# EAGLE design arduinoM0Mini_start (EAGLE 9.1.3)
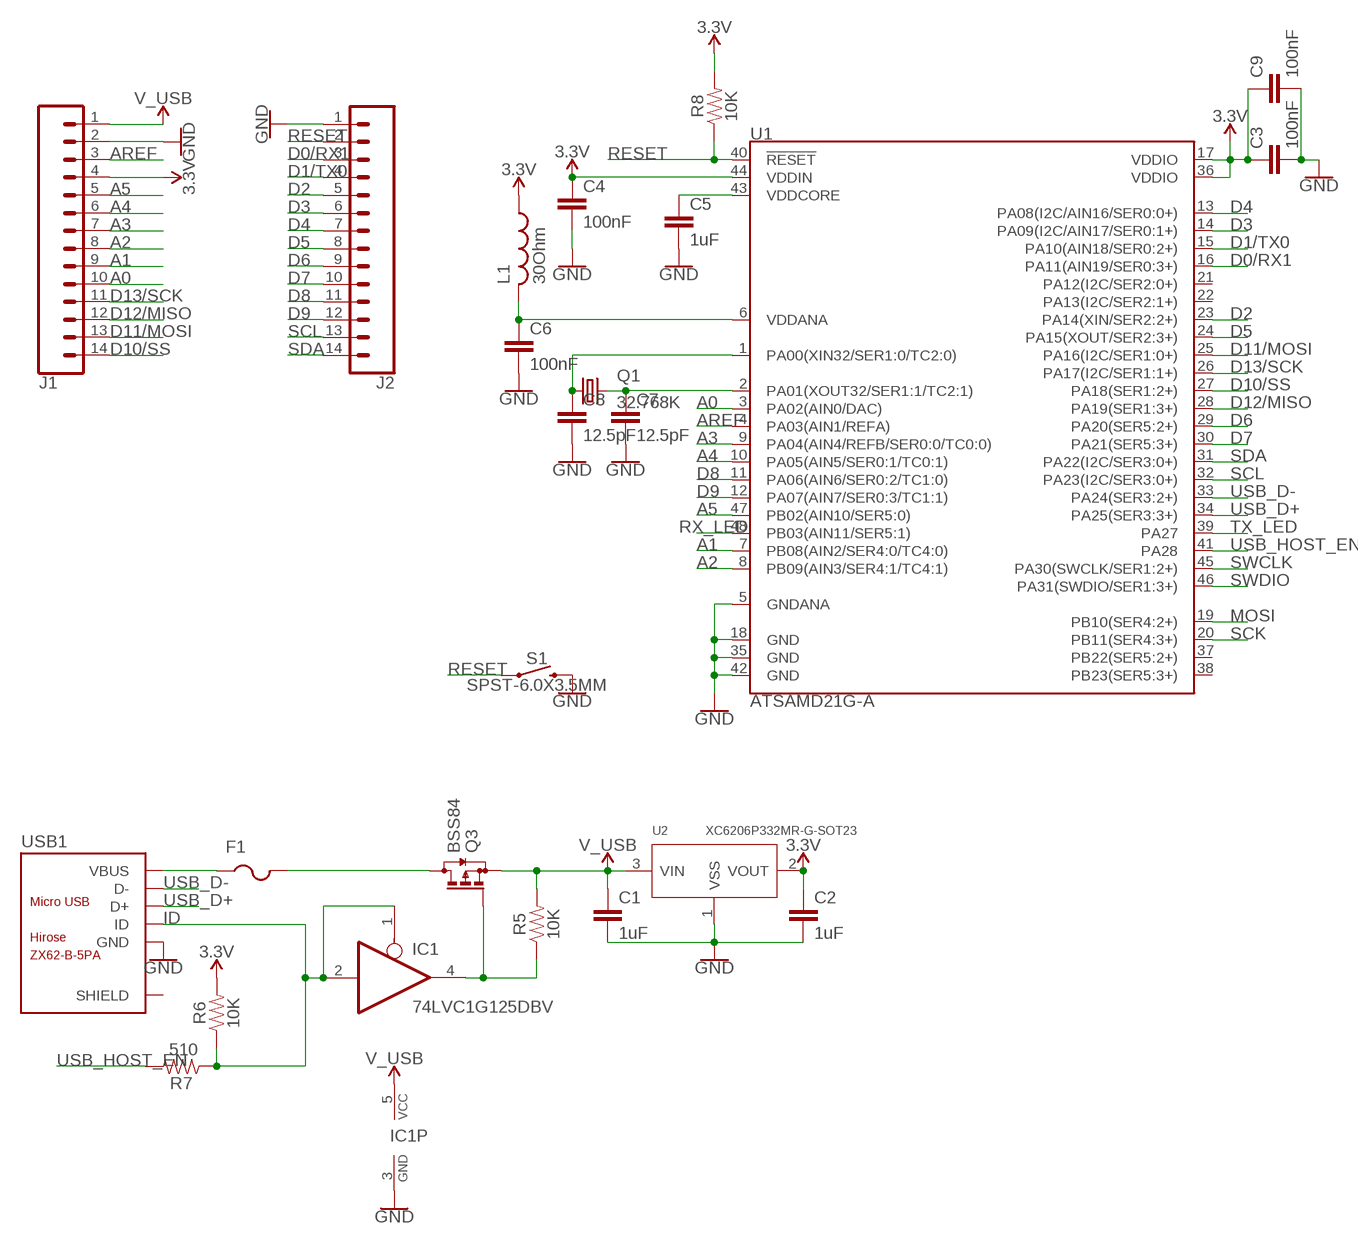
[diagram p0: schematic, sheet 1]

## Parts
C1  1uF  C-EUC0805K  [C0805K]
C2  1uF  C-EUC0805K  [C0805K]
C3  100nF  C-EUC0805K  [C0805K]
C4  100nF  C-EUC0805K  [C0805K]
C5  1uF  C-EUC0805K  [C0805K]
C6  100nF  C-EUC0805K  [C0805K]
C7  12.5pF  C-EUC0805K  [C0805K]
C8  12.5pF  C-EUC0805K  [C0805K]
C9  100nF  C-EUC0805K  [C0805K]
F1  PTCFUSE-1206  [R1206]
IC1  74LVC1G125DBV  [SOT23-5]
J1  CONN_14NO_SILK  [1X14_NO_SILK]
J2  CONN_14NO_SILK  [1X14_NO_SILK]
L1  30Ohm  INDUCTOR_0805_N  [RESC0805_N]
Q1  32.768K  KX-327-NHT  [3.2X1.5]
Q3  BSS84  [SOT23]
R5  10K  RESISTOR0805  [0805]
R6  10K  RESISTOR0805  [0805]
R7  510  RESISTOR0805  [0805]
R8  10K  RESISTOR0805  [0805]
S1  SPST-6.0X3.5MM  MOMENTARY-SWITCH-SPST-SMD-6.0X3.5MM  [TACTILE_SWITCH_SMD_6.0X3.5MM]
U1  ATSAMD21G-A  [TQFP-48]
U2  XC6206P332MR-G-SOT23  PMIC-LDO-XC6206P332MR-G(SOT23)  [SOT-23]
USB1  ZX62-B-5PA  MICRO-USB-SMD(ZX62-B-5PA)  [MICRO-USB5+6P-SMD-0.65-AB]

## Nets
3.3V: C2.1 C3.1 C4.1 C9.1 J1.4 L1.1 R6.2 R8.2 U1.17(VDDIO) U1.36(VDDIO) U1.44(VDDIN) U2.2(VOUT)
A0: J1.10 U1.3(PA02(AIN0/DAC))
A1: J1.9 U1.7(PB08(AIN2/SER4:0/TC4:0))
A2: J1.8 U1.8(PB09(AIN3/SER4:1/TC4:1))
A3: J1.7 U1.9(PA04(AIN4/REFB/SER0:0/TC0:0))
A4: J1.6 U1.10(PA05(AIN5/SER0:1/TC0:1))
A5: J1.5 U1.47(PB02(AIN10/SER5:0))
AREF: J1.3 U1.4(PA03(AIN1/REFA))
D0/RX1: J2.3 U1.16(PA11(AIN19/SER0:3+))
D1/TX0: J2.4 U1.15(PA10(AIN18/SER0:2+))
D2: J2.5 U1.23(PA14(XIN/SER2:2+))
D3: J2.6 U1.14(PA09(I2C/AIN17/SER0:1+))
D4: J2.7 U1.13(PA08(I2C/AIN16/SER0:0+))
D5: J2.8 U1.24(PA15(XOUT/SER2:3+))
D6: J2.9 U1.29(PA20(SER5:2+))
D7: J2.10 U1.30(PA21(SER5:3+))
D8: J2.11 U1.11(PA06(AIN6/SER0:2/TC1:0))
D9: J2.12 U1.12(PA07(AIN7/SER0:3/TC1:1))
D10/SS: J1.14 U1.27(PA18(SER1:2+))
D11/MOSI: J1.13 U1.25(PA16(I2C/SER1:0+))
D12/MISO: J1.12 U1.28(PA19(SER1:3+))
D13/SCK: J1.11 U1.26(PA17(I2C/SER1:1+))
GND: C1.2 C2.2 C3.2 C4.2 C5.2 C6.2 C7.2 C8.2 C9.2 IC1.3(GND) J1.2 J2.1 S1.2 U1.5(GNDANA) U1.18(GND) U1.35(GND) U1.42(GND) U2.1(VSS) USB1.5(GND)
ID: IC1.1(OE) IC1.2(I) R6.1 R7.1 USB1.4(ID)
MOSI: U1.19(PB10(SER4:2+))
N$3: C7.1 Q1.2 U1.2(PA01(XOUT32/SER1:1/TC2:1))
N$4: C8.1 Q1.1 U1.1(PA00(XIN32/SER1:0/TC2:0))
N$13: IC1.4(O) Q3.1(G) R5.1
N$14: F1.2 Q3.3(D)
RESET: J2.2 R8.1 S1.1 U1.40(!RESET!)
RX_LED: U1.48(PB03(AIN11/SER5:1))
SCK: U1.20(PB11(SER4:3+))
SCL: J2.13 U1.32(PA23(I2C/SER3:0+))
SDA: J2.14 U1.31(PA22(I2C/SER3:0+))
SWCLK: U1.45(PA30(SWCLK/SER1:2+))
SWDIO: U1.46(PA31(SWDIO/SER1:3+))
TX_LED: U1.39(PA27)
USB_D+: U1.34(PA25(SER3:3+)) USB1.3(D+)
USB_D-: U1.33(PA24(SER3:2+)) USB1.2(D-)
USB_HOST_EN: R7.2 U1.41(PA28)
V_USB: C1.1 IC1.5(VCC) J1.1 Q3.2(S) R5.2 U2.3(VIN)
V_USB_IN: F1.1 USB1.1(VBUS)
VDDADA: C6.1 L1.2 U1.6(VDDANA)
VDDCORE: C5.1 U1.43(VDDCORE)
Unconnected: U1.21(PA12(I2C/SER2:0+)) U1.22(PA13(I2C/SER2:1+)) U1.37(PB22(SER5:2+)) U1.38(PB23(SER5:3+)) USB1.P1(SHIELD) USB1.P2(SHIELD) USB1.P3(SHIELD) USB1.P4(SHIELD) USB1.P5(SHIELD) USB1.P6(SHIELD)

## Library data of the parts
C1 C2 C5 = rcl:C-EU: CAPACITOR, European symbol; LCSC: C16834; SPICEPREFIX: C
C3 C4 C6 C9 = rcl:C-EU: CAPACITOR, European symbol; LCSC: C1711; SPICEPREFIX: C
C7 C8 = rcl:C-EU: CAPACITOR, European symbol; LCSC: C1792; SPICEPREFIX: C
F1 = adafruit:PTCFUSE: PTC fuses, resettable thermistors; LCSC: C151162
IC1 = 74xx-little-us:74*1G125: Single Bus Buffer Gate with 3-State Output; LCSC: C23654
J1 J2 = SparkFun-Connectors:CONN_14: Multi connection point. Often used as Generic Header-pin footprint for 0.1 inch spaced/style header connections On any of the 0.1 inch spaced packages, you can populate with these: Break Away Headers - Straight <https://www.sparkfun.com/products/116> (PRT-00116) Break Away Male Headers - Right Angle <https://www.sparkfun.com/products/553> (PRT-00553) Female Headers <https://www.sparkfun.com/products/115> (PRT-00115) Break Away Headers - Machine Pin <https://www.sparkfun.com/products/117> (PRT-00117) Break Away Female Headers - Swiss Machine Pin <https://www.sparkfun.com/products/743> (PRT-00743) For SCREWTERMINALS and SPRING TERMINALS visit here: Screw Terimnals on SparkFun.com <https://www.sparkfun.com/search/results?term=Screw+Terminals> (5mm/3.5mm/2.54mm spacing) This device is also useful as a general connection point to wire up your design to another part of your project. Our various solder wires solder well into these plated through hole pads. Hook-Up Wire - Assortment (Stranded, 22 AWG) <https://www.sparkfun.com/products/11375> (PRT-11375) Hook-Up Wire - Assortment (Solid Core, 22 AWG) <https://www.sparkfun.com/products/11367> (PRT-11367) View the entire wire category on our website here <https://www.sparkfun.com/categories/141> Special notes: Molex polarized connector foot print use with SKU : PRT-08231 with associated crimp pins and housings. 1MM SMD Version SKU: PRT-10208 NOTES ON THE VARIANTS LOCK and LOCK_LONGPADS... This footprint was designed to help hold the alignment of a through-hole component (i.e. 6-pin header) while soldering it into place. You may notice that each hole has been shifted either up or down by 0.005 of an inch from it's more standard position (which is a perfectly straight line). This slight alteration caused the pins (the squares in the middle) to touch the edges of the holes. Because they are alternating, it causes a "brace" to hold the component in place. 0.005 has proven to be the perfect amount of "off-center" position when using our standard breakaway headers. Although looks a little odd when you look at the bare footprint, once you have a header in there, the alteration is very hard to notice. Also,if you push a header all the way into place, it is covered up entirely on the bottom side.
L1 = Nordic_nRF:INDUCTOR: Generic chip inductor; LCSC: C139190
Q1 = crystal-geyer_V1_0:KX-327: Tuning Fork Crystals (kHz) SMD: KX327 - Serie Model Size l/w/h [mm] Frequency Range Frequency Stability Temp. Range [°C] Load Capacitance AECQ 200 availabel Datasheet KX-327VT KX-327FT KX-327RT KX-327NHT KX-327NHF KX-327L KX-327S 1.25/1.05/0.5 1.6/1.0/0.5 2.0/1.2/0.6 3.2/1.5/0.8 3.2/1.5/0.8 7.0/1.5/1.4 8.2/3.8/2.5 32,768 kHz 32,768 kHz 32,768 kHz 32,768 kHz 32,768 kHz 32,768 kHz 32,768 kHz ±10 … ±20ppm ±10 … ±20ppm ±10 … ±20ppm ±10 … ±20ppm ±10 … ±20ppm ±10 … ±20ppm ±5 … ±20ppm (*) -40°C …+85°C (*) -40°C …+85°C (*) -40°C …+85°C (*) -40°C …+85°C (*) -40°C …+125°C (*) -40°C …+85°C (*) -40°C …+85°C 7/9/12,5 7/9/12,5 7/9/12,6 7/9/12,5 9/12,5 7/9/12,5 6/12,5 - - - - yes - - KX-327VT.pdf <http://www.geyer-electronic.de/uploads/tx_userartikelfrequenz/GEYER-KX-327VT.pdf> KX-327FT.pdf <http://www.geyer-electronic.de/uploads/tx_userartikelfrequenz/GEYER-KX-327FT.pdf> KX-327RT.pdf <http://www.geyer-electronic.de/uploads/tx_userartikelfrequenz/GEYER-KX-327RT.pdf> KX-327NHT.pdf <http://www.geyer-electronic.de/uploads/tx_userartikelfrequenz/GEYER-KX-327NHT.pdf> KX-327NHF.pdf <http://www.geyer-electronic.de/uploads/tx_userartikelfrequenz/GEYER-KX-327NHF.pdf> KX-327L.pdf <http://www.geyer-electronic.de/uploads/tx_userartikelfrequenz/GEYER-KX-327L.pdf> KX-327S.pdf <http://www.geyer-electronic.de/uploads/tx_userartikelfrequenz/GEYER-KX-327S.pdf> <http://www.geyer-electronic.de/fileadmin/template/img/logo-geyer-electronic.png> Details see: http://www.geyer-electronic.de/Frequenz-Produkte.9.0.html Created 2016-06-07, Hans Locher 2016 (C) Geyer Quartz Technology KX327VT,KX327FT,KX327RT,KX327NHT,KX327NHF,KX327S,KX327L;125105;1610;2012;3215;7015;8238;1,25x1,05,1.25x1.05;1,6x1,0,1.6x1.0;2,0x1,2,2.0x1.2;3,2x1,5,3.2x1.5;8,2x3,8,8.2x3.8,7.0x1.5,7,0x1,532.768kHz; LCSC: C32346
Q3 = transistor-small-signal:BSS84: P-CHANNEL MOS FET; LCSC: C8492
R5 R6 R8 = SparkFun-Resistors:RESISTOR: Generic Resistor Package; LCSC: C115309
R7 = SparkFun-Resistors:RESISTOR: Generic Resistor Package; LCSC: C17734
S1 = SparkFun-Switches:MOMENTARY-SWITCH-SPST: Momentary Switch (Pushbutton) - SPST Normally-open (NO) SPST momentary switches (buttons, pushbuttons). Variants PTH-12MM - 12mm square, through-hole Momentary Pushbutton Switch - 12mm Square <https://www.sparkfun.com/products/9190> (COM-09190) PTH-6.0MM, PTH-6.0MM-KIT - 6.0mm square, through-hole Mini Pushbutton Switch <https://www.sparkfun.com/products/97> (COM-00097) KIT package intended for soldering kit's - only one side of pads' copper is exposed. PTH-RIGHT-ANGLE-KIT - Right-angle, through-hole Right Angle Tactile Button <https://www.sparkfun.com/products/10791> - Used on SparkFun BigTime Watch Kit <https://www.sparkfun.com/products/11734> SMD-12MM - 12mm square, surface-mount Tactile Button - SMD (12mm) <https://www.sparkfun.com/products/12993> (COM-12993) Used on SparkFun PicoBoard <https://www.sparkfun.com/products/11888> SMD-4.5MM - 4.5mm Square Trackball Switch Used on SparkFun Blackberry Trackballer Breakout <https://www.sparkfun.com/products/13169> SMD-4.6MMX2.8MM - 4.60mm x 2.80mm, surface mount Used on SparkFun SAMD21 Mini Breakout <https://www.sparkfun.com/products/13664> SMD-5.2MM, SMD-5.2-REDUNDANT - 5.2mm square, surface-mount Mini Pushbutton Switch - SMD <https://www.sparkfun.com/products/8720> (COM-08720) Used on Arduino Pro Mini <https://www.sparkfun.com/products/11114> REDUNDANT package connects both switch circuits together SMD-6.0X3.5MM - 6.0 x 3.5mm, surface mount Momentary Reset Switch SMD <https://www.sparkfun.com/products/8229> (COM-08229) SMD-6.2MM-TALL - 6.2mm square, surface mount Tactile Button - SMD (6mm) <https://www.sparkfun.com/products/12992> Used on SparkFun Digital Sandbox <https://www.sparkfun.com/products/12651> SMD-RIGHT-ANGLE - Right-angle, surface mount Used on SparkFun Block for Intel® Edison - Arduino <https://www.sparkfun.com/products/13036>; LCSC: C139783; PROD_ID: SWCH-00815; SF_SKU: COM-08229
U1 = SparkFun-IC-Microcontroller:ATSAMD21G: Atmel SAMD21G SMART ARM-Based Microcontroller The Atmel ® | SMART ™ SAM D21 is a series of low-power microcontrollers using the 32-bit ARM ® Cortex ® -M0+ processor, and ranging from 32- to 64-pins with up to 256KB Flash and 32KB of SRAM. The SAM D21 devices operate at a maximum frequency of 48MHz and reach 2.46 CoreMark/MHz. They are designed for simple and intuitive migration with identical peripheral modules, hex compatible code, identical linear address map and pin compatible migration paths between all devices in the product series. All devices include intelligent and flexible peripherals, Atmel Event System for inter-peripheral signaling, and support for capacitive touch button, slider and wheel user interfaces. Datasheet <https://cdn.sparkfun.com/datasheets/Dev/Arduino/Boards/Atmel-42181-SAM-D21_Datasheet.pdf> SparkFun Products SparkFun SAMD21 Mini Breakout <https://www.sparkfun.com/products/13664> (DEV-13664) SparkFun SAMD21 Dev Breakout <https://www.sparkfun.com/products/13672> (DEV-13672); PROD_ID: IC-13064
U2 = Seeed-IC:PMIC-LDO-XC6206P332MR-G(SOT23): 310030099; LCSC: C5446; MPN: XC6206P332MR-G
USB1 = Seeed-Connector:MICRO-USB-SMD(ZX62-B-5PA): 320010005; LCSC: C10418; MPN: ZX62-B-5PA

## Board
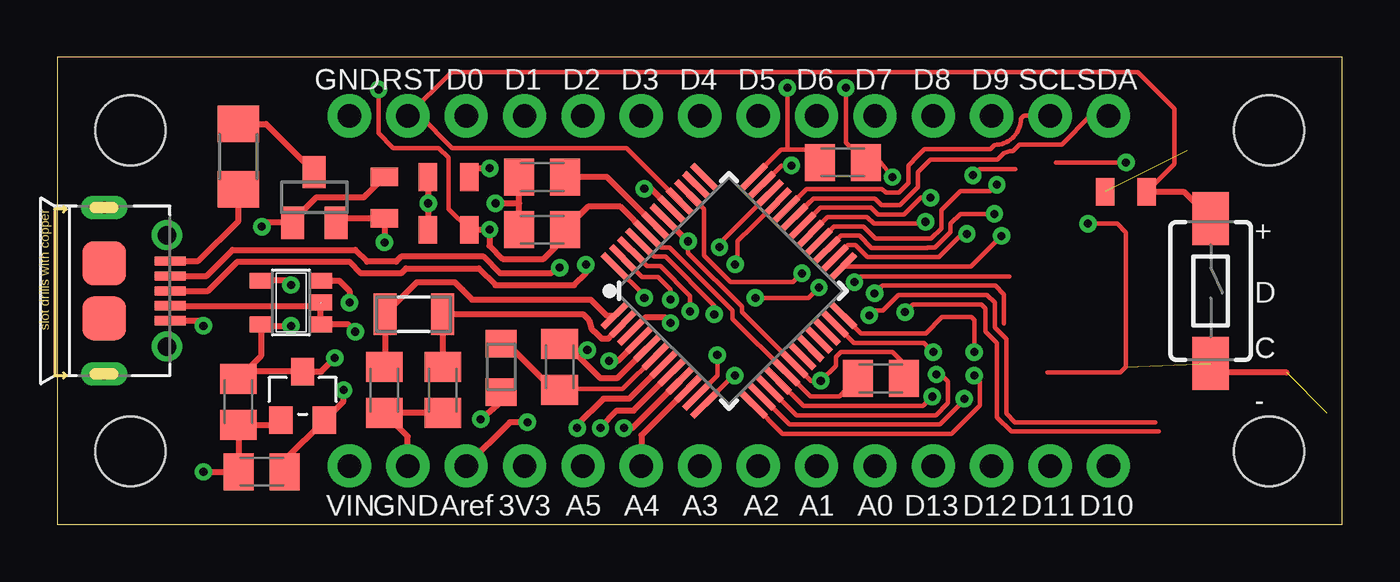
[diagram p1: board, top side]
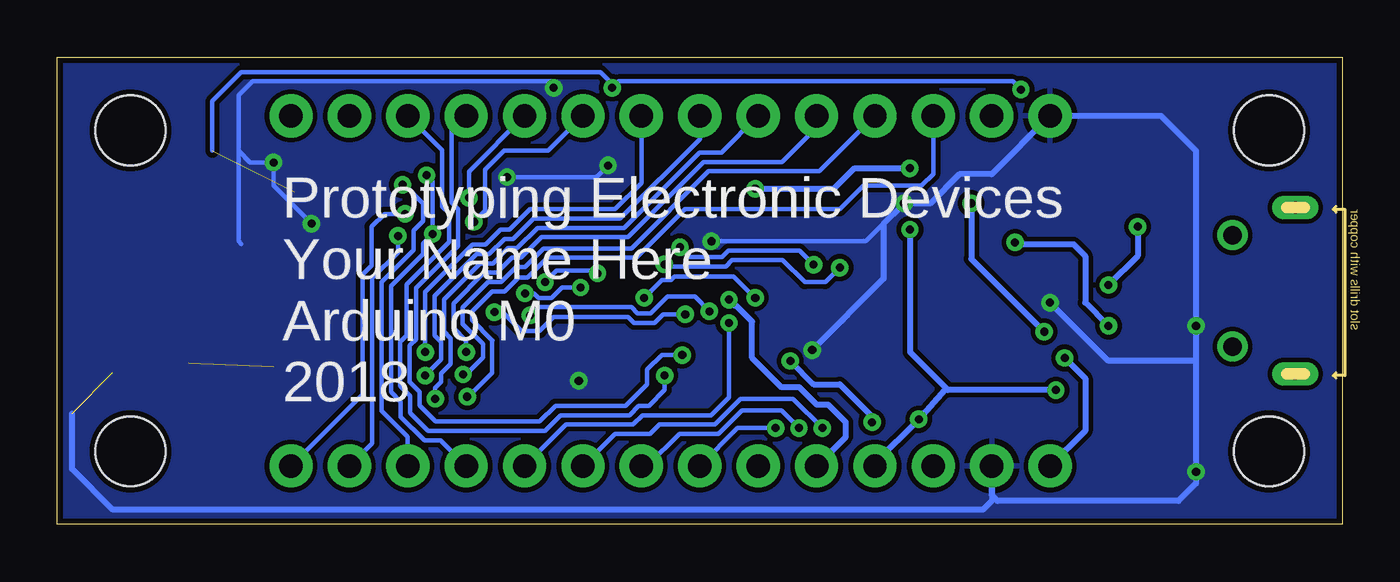
[diagram p2: board, bottom side, seen from below]

Size 55.88 x 20.32 mm. Coordinates in mm from the lower left corner, seen from the top.
Outline: 0,0 55.88,0 55.88,20.32 0,20.32 0,0
Copper layers (1*16): Top 0.035mm / dielectric 1.5mm / Bottom 0.035mm
Design rules "eagleRules *": minimum track width 8mil, minimum drill 0.3mm, track to track 8mil, track to pad 8mil, pad to pad 8mil, via to via 8mil, smd to smd 8mil, copper to edge 10mil, drill to drill 20mil, minimum pad ring 10mil, minimum via ring 8mil, stop-mask expansion 4mil, vias tented up to drill 16mil, thermal gap 10mil
Holes 3.05 mm at 3.17,17.14 3.17,3.17 52.7,17.14 52.7,3.17

### Footprints (pad centres in the part's own frame; a part is rotated, then mirrored left to right if it is on the bottom)
C0805K = smd 1.3 x 1.6: 1 -1,0; 2 1,0
R1206 = smd 1.6 x 1.803: 1 -1.422,0; 2 1.422,0
SOT23-5 = smd 0.69 x 0.99: 1 -0.95,-1.29; 2 0,-1.29; 3 0.95,-1.29; 4 0.95,1.3; 5 -0.95,1.3
1X14_NO_SILK = drill 1.016 pad 1.88: 1 0,0; 2 2.54,0; 3 5.08,0; 4 7.62,0; 5 10.16,0; 6 12.7,0; 7 15.24,0; 8 17.78,0; 9 20.32,0; 10 22.86,0; 11 25.4,0; 12 27.94,0; 13 30.48,0; 14 33.02,0
RESC0805_N = smd 1.2 x 1.35: 1 -1.1,0; 2 1,0
3.2X1.5 = smd 1 x 1.8: 1 -1.25,0; 2 1.25,0
SOT23 = smd 1 x 1.4: 1 -0.95,-1.1; 2 0.95,-1.1; 3 0,1.1
0805 = smd 0.8 x 1.2: 1 -0.9,0; 2 0.9,0
TACTILE_SWITCH_SMD_6.0X3.5MM = smd 2.3 x 1.6: 1 -3.15,0; 2 3.15,0
TQFP-48 = smd 1.5 x 0.28: 1 -4.25,2.75; 2 -4.25,2.25; 3 -4.25,1.75; 4 -4.25,1.25; 5 -4.25,0.75; 6 -4.25,0.25; 7 -4.25,-0.25; 8 -4.25,-0.75; 9 -4.25,-1.25; 10 -4.25,-1.75; 11 -4.25,-2.25; 12 -4.25,-2.75; 25 4.25,-2.75; 26 4.25,-2.25; 27 4.25,-1.75; 28 4.25,-1.25; 29 4.25,-0.75; 30 4.25,-0.25; 31 4.25,0.25; 32 4.25,0.75; 33 4.25,1.25; 34 4.25,1.75; 35 4.25,2.25; 36 4.25,2.75 | smd 0.28 x 1.5: 13 -2.75,-4.25; 14 -2.25,-4.25; 15 -1.75,-4.25; 16 -1.25,-4.25; 17 -0.75,-4.25; 18 -0.25,-4.25; 19 0.25,-4.25; 20 0.75,-4.25; 21 1.25,-4.25; 22 1.75,-4.25; 23 2.25,-4.25; 24 2.75,-4.25; 37 2.75,4.25; 38 2.25,4.25; 39 1.75,4.25; 40 1.25,4.25; 41 0.75,4.25; 42 0.25,4.25; 43 -0.25,4.25; 44 -0.75,4.25; 45 -1.25,4.25; 46 -1.75,4.25; 47 -2.25,4.25; 48 -2.75,4.25
SOT-23 = smd 1.016 x 1.2: 1 -0.95,-1.06; 2 0.95,-1.06; 3 0,1.06
MICRO-USB5+6P-SMD-0.65-AB = smd 0.4 x 1.35: 1 -1.3,2.875; 2 -0.65,2.875; 3 0,2.875; 4 0.65,2.875; 5 1.3,2.875 | smd 1.9 x 1.9: P1 -1.2,0; P2 1.2,0 | drill 0.508 pad 1.016 long: P3 -3.625,0; P4 3.625,0 | drill 0.8: P5 -2.425,2.73; P6 2.425,2.73

### Placement (x,y rotation side)
C1  7.87,5.33 270 top
C2  8.89,2.29 180 top
C3  35.81,6.35 0 top
C4  21.08,12.83 180 top
C5  21.08,15.11 180 top
C6  21.84,6.86 90 top
C7  16.76,5.84 270 top
C8  14.22,5.84 270 top
C9  34.16,15.75 0 top
F1  7.87,16 90 top
IC1  10.16,9.65 90 top
J1  12.7,2.54 0 top
J2  12.7,17.78 0 top
L1  19.3,6.86 90 top
Q1  15.49,9.14 0 top
Q3  11.18,14.22 0 top
R5  14.22,14.22 270 top
R6  17.02,12.83 0 top
R7  17.02,15.11 0 top
R8  46.48,14.48 180 top
S1  50.16,10.16 270 top
U1  29.21,10.16 45 top
U2  10.67,5.59 0 top
USB1  2.03,10.16 270 top

### Tracks (layer width: path | path; a pad name or v marks a point on that pad's centre or on a via)
3.3V  (via drill 0.35)  (1 unrouted)
  Top 0.203: R6.2 17.02,13.73 17.02,15.95 16.59,16.38 14.61,16.38 13.97,17.02 v13.97,18.92 | U1.44 26.25,12.05 26.62,12.05 29.37,9.3 29.37,8.94 U1.17 32.75,5.56 34.03,5.56 C3.1 | U1.36 31.47,16.31 31.75,16.31 | 31.75,16.31 32.6,16.31 C9.1 | 31.75,19.18 v31.75,19 31.75,16.31
  Top 0.254: C2.1 9.89,2.8 U2.2 12.45,5.36 v12.45,5.84 | v18.41,4.57 19.3,5.33 L1.1 | R6.2 v18.8,12.83 18.8,12.12 19.36,11.56 21.15,11.56 22.08,12.48 C4.1 23.08,13.82 24.49,13.82 U1.44
  Bottom 0.203: v13.97,18.92 14.33,19.28 31.47,19.28 31.66,19.09 | 49.15,16.26 49.15,18.41 47.88,19.68 32.26,19.68 31.66,19.09 | 31.66,19.09 v31.75,19
  Bottom 0.254: v12.45,5.84 17.14,5.84 | 17.14,5.84 17.27,5.84 v18.41,4.57 20.32,2.67 J1.4 | v18.8,12.83 18.8,7.49 17.14,5.84
A0  (via drill 0.35)
  Top 0.254: U1.3 25.59,9.02 26.42,9.02 v26.67,8.76
  Bottom 0.203: v26.67,8.76 | v26.67,8.76 26.67,5.53 27.45,4.75 30.43,4.75 30.84,4.34 33.76,4.34 J1.10
A1  (via drill 0.35)
  Top 0.254: U1.7 24.86,5.46 23.75,5.46 22.61,4.32 v22.61,4.19
  Bottom 0.203: v22.61,4.19 23.88,5.46 26.17,5.46 27.29,4.34 29.69,4.34 30.1,3.94 31.62,3.94 J1.9
A2  (via drill 0.35)
  Top 0.254: U1.8 25.06,4.95 24.33,4.95 23.62,4.25 v23.62,4.19
  Bottom 0.203: J1.8 30.23,2.54 28.83,3.94 27.12,3.94 26.1,4.95 24.38,4.95 v23.62,4.19
A3  (via drill 0.35)
  Top 0.254: U1.9 25.01,4.19 v24.64,4.19
  Bottom 0.203: v24.64,4.19 26.29,4.19 J1.7
A4
  Top 0.254: U1.10 25.4,3.88 J1.6
A5  (via drill 0.35)
  Top 0.203: v26.67,9.78 26.67,10.22 26.13,10.76 25.43,10.76 U1.47
  Bottom 0.254: J1.5 21.59,3.81 21.59,4.45 22.35,5.21 22.85,5.21 23.61,5.97 24.38,5.97 25.66,7.25 25.66,8.83 26.36,9.52 26.41,9.52 v26.67,9.78
AREF  (via drill 0.35)
  Top 0.254: U1.4 24.38,7.11 v24,7.11 | v20.45,4.45 19.68,4.45 J1.3
  Bottom 0.254: v24,7.11 22.99,6.1 21.84,6.1 20.45,4.7 v20.45,4.45
D0/RX1  (via drill 0.35)
  Top 0.203: U1.16 32.45,5.16 37.65,5.16 v38.05,5.56
  Bottom 0.203: J2.3 17.78,15.24 18.29,14.73 20.83,14.73 21.84,13.72 28.57,13.72 30.69,11.61 34.57,11.61 35.44,10.73 35.83,10.73 36.42,10.14 36.98,10.14 37.85,9.27 37.85,8.89 36.97,8.01 | 36.97,8.01 36.96,8 | 36.97,8.01 36.97,6.6 38,5.56 v38.05,5.56
D1/TX0  (via drill 0.35)
  Top 0.203: U1.15 32.15,4.75 38.21,4.75 38.73,5.27 38.73,6.22 38.43,6.53 v38.23,6.53
  Bottom 0.203: J2.4 22.73,15.37 27.56,15.37 30.91,12.01 34.74,12.01 35.55,11.2 35.93,11.2 36.59,10.54 37.15,10.54 38.25,9.44 38.25,8.72 37.37,7.84 37.37,7.25 38.1,6.53 v38.23,6.53
D2  (via drill 0.35)
  Top 0.203: U1.23 34.65,7.9 37.69,7.9 v38.1,7.49
  Bottom 0.203: J2.5 22.86,17.27 24.36,15.77 27.79,15.77 31.06,12.5 34.83,12.5 35.72,11.61 36.1,11.61 36.76,10.95 37.32,10.95 38.66,9.61 38.66,8.55 38.1,7.99 v38.1,7.49
D3  (via drill 0.35)
  Top 0.203: U1.14 31.84,4.34 38.38,4.34 39.45,5.41 v39.45,5.46
  Bottom 0.203: J2.6 27,16.18 27.96,16.18 31.23,12.9 35,12.9 35.88,12.01 36.27,12.01 36.93,11.36 37.49,11.36 39.06,9.78 39.06,8.38 38.78,8.1 38.78,6.99 39.2,6.57 39.2,6.19 39.45,5.94 v39.45,5.46
D4  (via drill 0.35)
  Top 0.203: U1.13 31.54,3.94 38.89,3.94 40.13,5.18 40.13,6.22 v39.88,6.48
  Bottom 0.203: J2.7 27.94,16.77 31.4,13.31 35.16,13.31 36.05,12.42 36.44,12.42 37.1,11.76 37.65,11.76 39.47,9.94 39.47,8.22 39.19,7.93 39.19,7.17 v39.88,6.48
D5  (via drill 0.35)
  Top 0.203: v39.88,7.49 39.88,8.89 39.75,9.02 38.48,9.02 37.77,8.31 34.95,8.31 U1.24
  Bottom 0.203: J2.8 30.48,14.86 31.62,13.72 35.33,13.72 36.22,12.83 36.61,12.83 37.26,12.17 37.82,12.17 39.88,10.11 39.88,9.27 | 39.88,9.27 39.88,8.64 | 39.88,9.27 v39.88,7.49
D6  (via drill 0.35)
  Top 0.203: U1.29 33.48,13.37 35.22,13.37 35.51,13.08 37.68,13.08 v37.76,13.17
  Bottom 0.203: J2.9 34.54,16.26 36.45,16.26 37.27,15.43 37.27,13.65 v37.76,13.17
D7  (via drill 0.35)
  Top 0.203: U1.30 33.18,13.78 35.39,13.78 35.68,13.49 36.83,13.49 37.56,14.22 v37.98,14.22
  Bottom 0.203: 35.69,17.78 J2.10 37.98,15.36 v37.98,14.22
D8  (via drill 0.35)
  Top 0.203: U1.11 28.7,6.47 v28.7,7.37
  Bottom 0.203: J2.11 38.73,17.14 38.73,14 38.44,13.71 38.44,12.12 40.29,10.28 40.29,8.05 40.56,7.78 40.56,6.86 | v28.7,7.37 29.59,7.37 30.23,6.73 30.23,6.1 30.76,5.56 30.77,5.56 31.17,5.16 34.21,5.16 34.9,4.47 39.42,4.47 40.13,5.18 40.13,5.76 40.56,6.19 40.56,6.86 | 40.56,6.86 40.56,6.35
D9  (via drill 0.35)
  Top 0.203: U1.12 29.42,6.48 v29.46,6.48
  Bottom 0.203: J2.12 39.14,16.28 39.14,13.84 38.85,13.54 38.85,12.29 40.69,10.45 40.69,8.22 40.97,7.94 40.97,6.02 40.54,5.59 40.54,4.85 39.75,4.06 34.67,4.06 33.98,4.75 31,4.75 30.6,5.16 30.15,5.16 29.46,5.84 v29.46,6.48
D10/SS  (via drill 0.35)
  Top 0.203: U1.27 34.09,12.56 34.89,12.56 35.41,12.03 37.85,12.03 37.85,12.04 38.17,12.04 38.85,12.71 38.85,13.08 39.28,13.51 v40.76,13.51
  Bottom 0.203: v40.76,13.51 41.66,13.51 42.22,12.95 42.22,11.26 42.6,10.88 42.6,5.66 J1.14
D11/MOSI  (via drill 0.35)
  Top 0.203: U1.25 38.73,11.22 | 38.73,11.22 39.07,11.22 | 38.73,11.22 | v41.07,12.55 39.74,11.22 38.73,11.22
  Bottom 0.203: 41.19,12.55 v41.07,12.55 41.07,11.83 42.19,10.71 42.19,3.53 J1.13
D12/MISO  (via drill 0.35)
  Top 0.203: U1.28 33.78,12.97 35.05,12.97 35.58,12.44 36.95,12.44 36.96,12.45 38.01,12.45 38.44,12.88 38.44,13.68 39.27,14.51 40.59,14.51 v40.87,14.78
  Bottom 0.203: v40.87,14.78 40.78,14.78 39.97,13.97 39.97,13.2 40.39,12.78 40.39,11.94 40.9,11.43 41.4,10.93 41.78,10.54 41.78,4.95 40.64,3.8 J1.12
D13/SCK  (via drill 0.35)
  Top 0.203: U1.26 34.39,12.15 34.72,12.15 35.24,11.63 38.34,11.63 39.22,12.51 v39.56,12.64 | 41.68,15.47 40.1,15.47 v39.82,15.19
  Bottom 0.203: v39.82,15.19 39.56,14.93 v39.56,12.64 39.98,12.22 39.98,11.77 41.38,10.38 41.38,5.77 40.95,5.33 40.95,4.68 39.92,3.66 39.22,3.66 J1.11
GND  (via drill 0.35)  (2 unrouted)
  Top 0.203: v27.43,12.32 27.43,11.82 29.78,9.47 29.78,9.24 U1.18 32.77,6.25 v33.2,6.25 33.86,6.9 33.86,7.28 34.08,7.49 36.32,7.49 36.81,7 C3.2 | 30.7,14.76 U1.35 31.49,15.62 v31.93,15.62 | v34.29,19 34.29,16.62 C9.2 35.81,15.75 v36.32,15.11 | 43.43,15.75 v46.48,15.75 | v44.83,13.08 46.1,13.08 46.48,12.7 46.48,6.86 46.23,6.6 43.05,6.6
  Top 0.254: U2.1 9.52,4.33 C1.2 7.87,1.79 C2.2 v6.35,2.29 | v6.35,8.64 6.13,8.86 USB1.5 | IC1.3 12.26,10.6 12.7,10.16 v12.7,9.65 | J1.2 15.24,3.83 14.36,4.71 | 14.36,4.71 C8.2 | C7.2 14.49,4.84 14.36,4.71 | C4.2 20.08,13.97 | 20.08,13.97 C5.2 | 20.08,13.97 v19.05,13.97 | U1.5 24.34,6.35 23.62,6.35 22.86,7.11 | C6.2 22.11,7.86 22.86,7.11 | 22.86,7.11 22.86,7.4 v23.05,7.58 | U1.42 27.41,12.32 v27.43,12.32 | S1.2 50.57,6.6 53.47,6.6
  Bottom 0.203: 48.01,16.26 48.01,18.67 47.4,19.28 34.29,19.28 v34.29,19 | v27.43,12.32 20.7,12.32 19.18,13.84 | v36.32,15.11 32.44,15.11 v31.93,15.62 | 48.01,16.26 47.5,15.75 v46.48,15.75 46.48,14.73 v44.83,13.08 | 48.01,16.26 48.01,12.32 47.88,12.19
  Bottom 0.254: 6.35,7.11 v6.35,8.64 6.35,16.26 7.87,17.78 J2.1 15.24,15.24 16.64,15.24 17.91,13.97 v19.05,13.97 19.18,13.84 19.94,13.08 19.94,10.69 v23.05,7.58 | 6.35,7.11 v6.35,2.29 6.35,1.78 7.11,1.02 14.99,1.02 15.24,1.27 J1.2 15.24,1.02 15.62,0.64 53.47,0.64 55.24,2.41 55.24,4.83 | 6.35,7.11 10.16,7.11 v12.7,9.65
  pour Bottom: 0,20.32 55.88,20.32 55.88,0 0,0
ID  (via drill 0.35)
  Top 0.254: USB1.4 11.31,9.51 IC1.2 IC1.1 12.63,8.7 v12.95,8.38 | R7.1 16.12,13.98 v16.13,13.97 16.12,13.96 R6.1
  Bottom 0.254: v16.13,13.97 16.13,11.56 v12.95,8.38
N$3
  Top 0.203: U1.2 23.96,8.09
  Top 0.254: C7.1 16.74,6.86 Q1.2 22.86,9.14 23.11,8.89 23.24,8.51 23.37,8.38 23.38,8.38 23.67,8.09 23.96,8.09 | U1.2 24,8.13
N$4
  Top 0.254: C8.1 14.24,6.86 Q1.1 15.64,10.54 17.29,10.54 17.62,10.2 17.62,10.19 18.03,9.78 23.2,9.78 23.88,9.1 U1.1
N$13  (via drill 0.35)
  Top 0.254: Q3.1 10.16,13.12 | 10.16,13.12 9.06,13.12 v8.89,12.95 | v10.16,10.41 9.97,10.6 IC1.4 | R5.1 13.32,14.22 11.26,14.22 10.16,13.12
  Bottom 0.254: v8.89,12.95 8.89,11.68 v10.16,10.41
N$14
  Top 0.254: F1.2 9.08,17.42 Q3.3
RESET
  Top 0.203: U1.40 24.75,16.38 17.16,16.38 15.77,17.78 J2.2 17.14,19.68 46.99,19.68 48.58,18.1 48.58,15.67 R8.1
  Top 0.254: R8.1 49,14.48 S1.1
RX_LED  (via drill 0.35)
  Top 0.203: U1.48 25.53,9.95 v25.53,9.86 | v30.36,9.86 32.68,9.86 v33.13,10.31 | 41.18,8.73 41.18,10 40.79,10.39 35.88,10.39 v35.54,10.05
  Bottom 0.203: v25.53,9.86 26.46,10.79 29.03,10.79 29.19,10.63 29.58,10.63 v30.36,9.86 | v33.13,10.31 33.94,10.31 34.39,9.86 34.95,9.86 35.15,10.05 v35.54,10.05
SCL
  Top 0.203: J2.13 42.04,17.78 41.91,17.65 arc-90 40.77,16.51 40.58,16.32 37.72,16.32 37.44,16.04 37.02,15.62 37.02,14.85 36.6,14.43 36.04,14.43 35.88,14.59 32.58,14.59 U1.32
SDA
  Top 0.203: 41.55,16.24 41.56,16.24 | J2.14 44.94,17.78 43.7,16.54 41.85,16.54 41.55,16.24 | 41.55,16.24 41.42,16.24 41.17,16.15 40.89,15.88 37.97,15.88 37.43,15.33 37.43,14.68 36.65,13.89 35.85,13.89 35.56,14.19 32.88,14.19 U1.31 32.74,14.04
SWCLK  (via drill 0.35)
  Top 0.203: U1.45 25.95,11.65 26.45,11.65 28.57,9.53 v28.57,9.14 | v36.87,9.23 37.21,9.58 40.19,9.58 40.37,9.4 40.37,8.4 40.87,7.89 40.87,5.59 40.87,5.46 40.87,4.66 41.49,4.04 47.92,4.04
  Bottom 0.203: v28.57,9.14 29.54,9.14 29.91,8.77 30.81,8.77 31.06,9.02 34.3,9.02 34.91,8.41 35.69,8.41 36.51,9.23 v36.87,9.23
SWDIO  (via drill 0.35)
  Top 0.203: U1.46 25.65,11.24 26.22,11.24 27.52,9.95 v27.52,9.27 | 47.75,4.45 41.66,4.45 41.27,4.83 41.27,8.06 40.77,8.56 40.77,9.65 40.44,9.98 36.58,9.98 35.9,9.31 35.53,9.31 v35.31,9.09
  Bottom 0.203: v27.52,9.27 28.15,9.91 29.34,9.91 30.07,9.18 30.64,9.18 30.91,9.45 34.92,9.45 35.06,9.31 v35.31,9.09
TX_LED  (via drill 0.35)
  Top 0.203: U1.39 28.11,13.73 28.11,11.71 29.28,10.54 32,10.54 v32.38,10.92 | v34.67,10.54 34.93,10.79 41.4,10.79
  Bottom 0.203: v34.67,10.54 34.16,11.05 32.51,11.05 v32.38,10.92
USB_D+  (via drill 0.35)
  Top 0.203: v28.8,12.06 28.8,12.22 U1.34
  Top 0.254: USB1.3 6.56,10.16 7.83,11.43 12.7,11.43 13.21,10.92 14.94,10.92 15.16,11.14 18.33,11.14 19.05,10.41 22.48,10.41 22.99,10.92 v22.99,11.3
  Bottom 0.203: v22.99,11.3 23.6,11.91 26.7,11.91 26.97,11.64 28.37,11.64 v28.8,12.06
USB_D-  (via drill 0.35)
  Top 0.203: U1.33 30.24,12.95 30.23,12.95 29.59,12.32 29.59,11.43 v29.48,11.31
  Top 0.254: USB1.2 6.49,10.81 7.62,11.94 12.95,11.94 13.46,11.43 14.73,11.43 14.95,11.65 18.54,11.65 19.26,10.92 21.46,10.92 21.71,11.17 v21.84,11.17
  Bottom 0.203: v21.84,11.17 22.48,10.54 23.37,10.54 24.33,11.51 26.53,11.51 26.8,11.23 29.39,11.23 v29.48,11.31
USB_HOST_EN  (via drill 0.35)
  Top 0.254: U1.41 25.83,14.61 v25.53,14.61 | R7.2 18.3,15.49 v18.8,15.49
  Bottom 0.254: v25.53,14.61 22.1,14.61 21.21,15.49 v18.8,15.49
V_USB  (via drill 0.35)
  Top 0.254: 8.19,6.65 U2.3 11.47,6.65 v12.06,7.24 | 8.19,6.65 C1.1 | 8.19,6.65 8.86,7.32 IC1.5 8.93,8.64 v10.16,8.64 | Q3.2 12.33,13.32 R5.2 v14.22,12.27
  Bottom 0.254: v10.16,8.64 11.18,9.65 11.18,11.68 11.68,12.19 11.69,12.19 14.15,12.19 v14.22,12.27 | v12.06,7.24 11.18,6.35 11.18,4.06 J1.1
V_USB_IN
  Top 0.254: USB1.1 6.13,11.46 7.87,13.21 F1.1
VDDADA
  Top 0.203: C6.1 22.23,5.86 22.26,5.89 24.59,5.89 U1.6
  Top 0.254: L1.2 19.57,7.86 21.57,5.86 C6.1
VDDCORE
  Top 0.254: U1.43 23.9,15.11 C5.1

### Text on the board
tPlace: GND | RST | D0 | D1 | D2 | D3 | D4 | D5 | D6 | D7 | D8 | D9 | SCL | SDA | + | D | C | - | VIN | GND | Aref | 3V3 | A5 | A4 | A3 | A2 | A1 | A0 | D13 | D12 | D11 | D10
bPlace: Prototyping Electronic Devices / Your Name Here / Arduino M0 / 2018
tDocu: RX | TX